# EAGLE design Joystick (EAGLE 5.10)
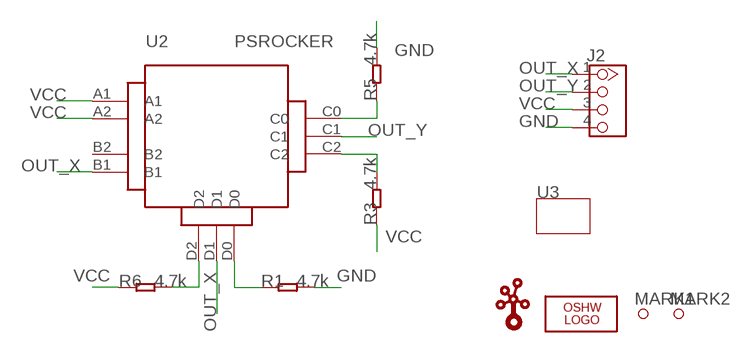
[diagram p0: schematic, sheet 1]

## Parts
J2  TWIG-2.0-LEADED  [4P-LEADED-2.0]
LOGO1  LOGO-OSHW-FILLX0150-NT  [OSHW_FILLX150_NOTEXT]
MARK1  PAD-MARK  [MARK]
MARK2  PAD-MARK  [MARK]
R1  4.7k  R-0603  [0603]
R3  4.7k  R-0603  [0603]
R5  4.7k  R-0603  [0603]
R6  4.7k  R-0603  [0603]
U2  PSROCKER  [PSROCKER]
U3  TWIG-2U  [2U-DIM-W/-DRILL]
U$1  TWIGLOGOTWIGLOGO_SMALL  [TWIGLOGO_SMALL]

## Nets
GND: J2.4 R1.2 R5.2
N$3: R3.2 U2.C2
N$4: R6.2 U2.D2
N$5: R1.1 U2.D0
N$6: R5.1 U2.C0
OUT_X: J2.1 U2.B1 U2.D1
OUT_Y: J2.2 U2.C1
VCC: J2.3 R3.1 R6.1 U2.A1 U2.A2
Unconnected: U2.B2

## Library data of the parts
J2 = Connector:TWIG-2.0-LEADED
LOGO1 = Logo:LOGO-OSHW-FILL
MARK1 MARK2 = Discrete:PAD-MARK
R1 R3 R5 R6 = Discrete:R*
U2 = AnlogDevice:PSROCKER
U3 = Module:TWIG
U$1 = seeedleo:TWIGLOGO

## Board
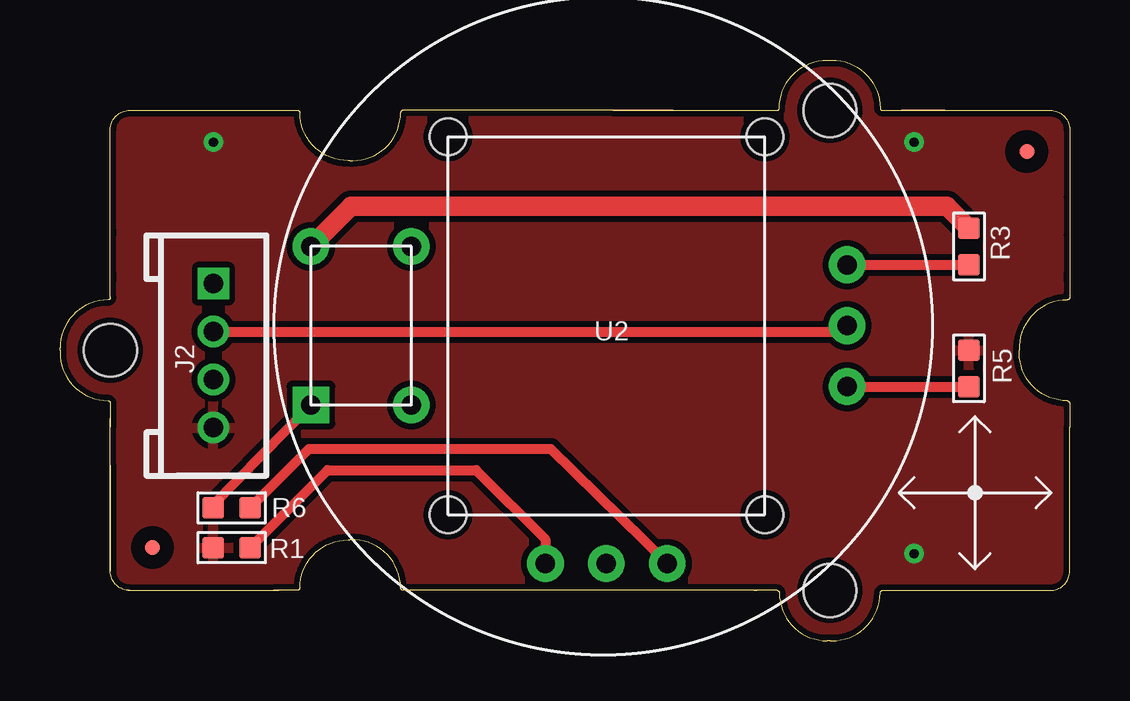
[diagram p1: board, top side]
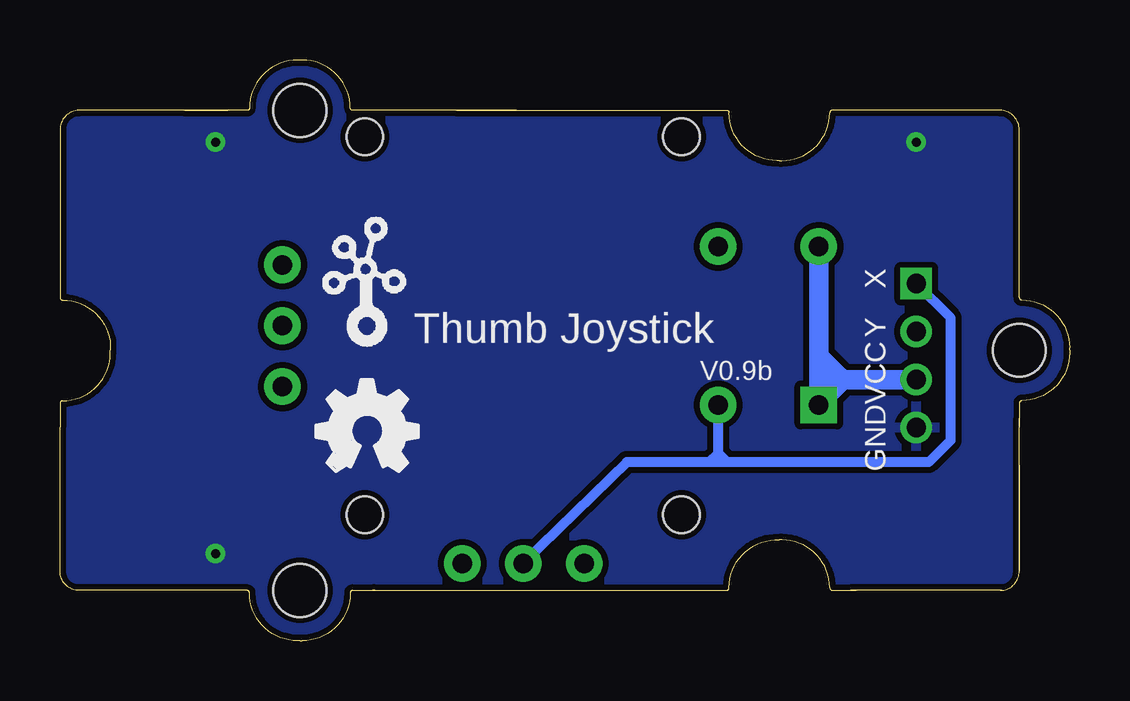
[diagram p2: board, bottom side, seen from below]

Size 42.09 x 24.2 mm. Coordinates in mm from the lower left corner, seen from the top.
Copper layers (1*16): Top 0.035mm / dielectric 1.5mm / Bottom 0.035mm
Design rules "SeeedStudio_rule_090524 *": minimum track width 0.0025mm, minimum drill 10mil, track to track 6mil, track to pad 6mil, pad to pad 6mil, via to via 6mil, smd to smd 6mil, copper to edge 10mil, drill to drill 10mil, minimum pad ring 10mil, minimum via ring 6mil, stop-mask expansion 2mil, vias tented up to drill 100mil, thermal gap 10mil

### Footprints (pad centres in the part's own frame; a part is rotated, then mirrored left to right if it is on the bottom)
4P-LEADED-2.0 = drill 0.8 pad 1.27 square: 1 -3,0 | drill 0.8 pad 1.27 round: 2 -1,0; 3 1,0; 4 3,0
MARK = smd 0.635 x 0.635: P$1 0,0
0603 = smd 0.889 x 0.889: 1 -0.762,0; 2 0.762,0
PSROCKER = drill 0.813 pad 1.524 square: A1 -3.302,12.319 | drill 0.813 pad 1.524 round: A2 3.302,12.319; B1 -3.302,8.128; B2 3.302,8.128; C0 -2.54,-10.033; C1 0,-10.033; C2 2.54,-10.033; D0 -9.906,2.54; D1 -9.906,0; D2 -9.906,-2.54 | hole 1.524: -7.874,6.604; 7.874,6.604; 7.874,-6.604; -7.874,-6.604
2U-DIM-W/-DRILL = hole 2.2: 10.453,-10.42; 10.453,9.58; -19.535,-0.415

### Placement (x,y rotation side)
J2  6.4,11.89 270 top
LOGO1  31.41,7.06 0 bottom
MARK1  40.3,20.39 0 top
MARK2  3.86,3.88 0 top
R1  7.16,3.88 180 top
R3  37.89,16.43 270 top
R5  37.89,11.35 90 top
R6  7.16,5.54 0 top
U2  22.78,13.13 90 top
U3  21.64,12.52 0 top
U$1  31.54,12.14 0 bottom

### Tracks (layer width: path | path; a pad name or v marks a point on that pad's centre or on a via)
GND  (via drill 0.38 pad 0.81)
  other vias: 6.4,20.77 35.61,3.63 35.61,20.77
  pour Bottom (isolate 0.254): -1.22,-0.18 -1.22,24.58 44.5,24.58 44.5,-0.18
  pour Top (isolate 0.254): -1.22,-0.18 -1.22,24.58 44.5,24.58 44.5,-0.18
N$3
  Top 0.406: U2.C2 R3.2
N$4
  Top 0.406: R6.2 10.38,7.99 20.45,7.99 U2.D2
N$5
  Top 0.406: R1.1 11.15,7.12 17.35,7.12 20.24,4.23 U2.D0
N$6
  Top 0.406: U2.C0 R5.1
OUT_X
  Bottom 0.406: J2.1 4.97,13.45 4.97,8.36 5.88,7.44 14.27,7.44 | U2.D1 18.46,7.44 15.03,7.44 | 14.27,7.44 14.65,7.44 | 14.65,7.44 15.03,7.44 | 14.65,7.44 14.65,7.82 | 14.65,7.82 U2.B1 | 14.65,7.82 15.03,7.44 | 14.27,7.44 14.65,7.82
OUT_Y
  Top 0.406: J2.2 32.67,12.89 U2.C1
VCC
  Top 0.406: R6.1 6.4,5.66 U2.A1
  Top 0.813: R3.1 36.98,18.11 12.14,18.11 U2.A2
  Bottom 0.813: U2.A1 10.46,10.61 | 10.46,10.61 10.46,11.89 | 10.46,11.89 U2.A2 | 9.45,10.89 10.19,10.89 10.46,10.61 | 9.45,10.89 J2.3 | 9.45,10.89 9.45,10.86 10.33,9.98 | 10.46,11.89 9.58,11

### Text on the board
bPlace: X | Y | Thumb Joystick | V0.9b | VCC | GND
tNames: U2